# EasyEDA schematic Sheet_1.json
TITLE: ESP32 DevKit4 JTAG Break Out Board; REV: 1.0; Date: 2023-02-11; Sheet: 1/1; Drawn By: ralphbacon; Company: Arduino YouTube
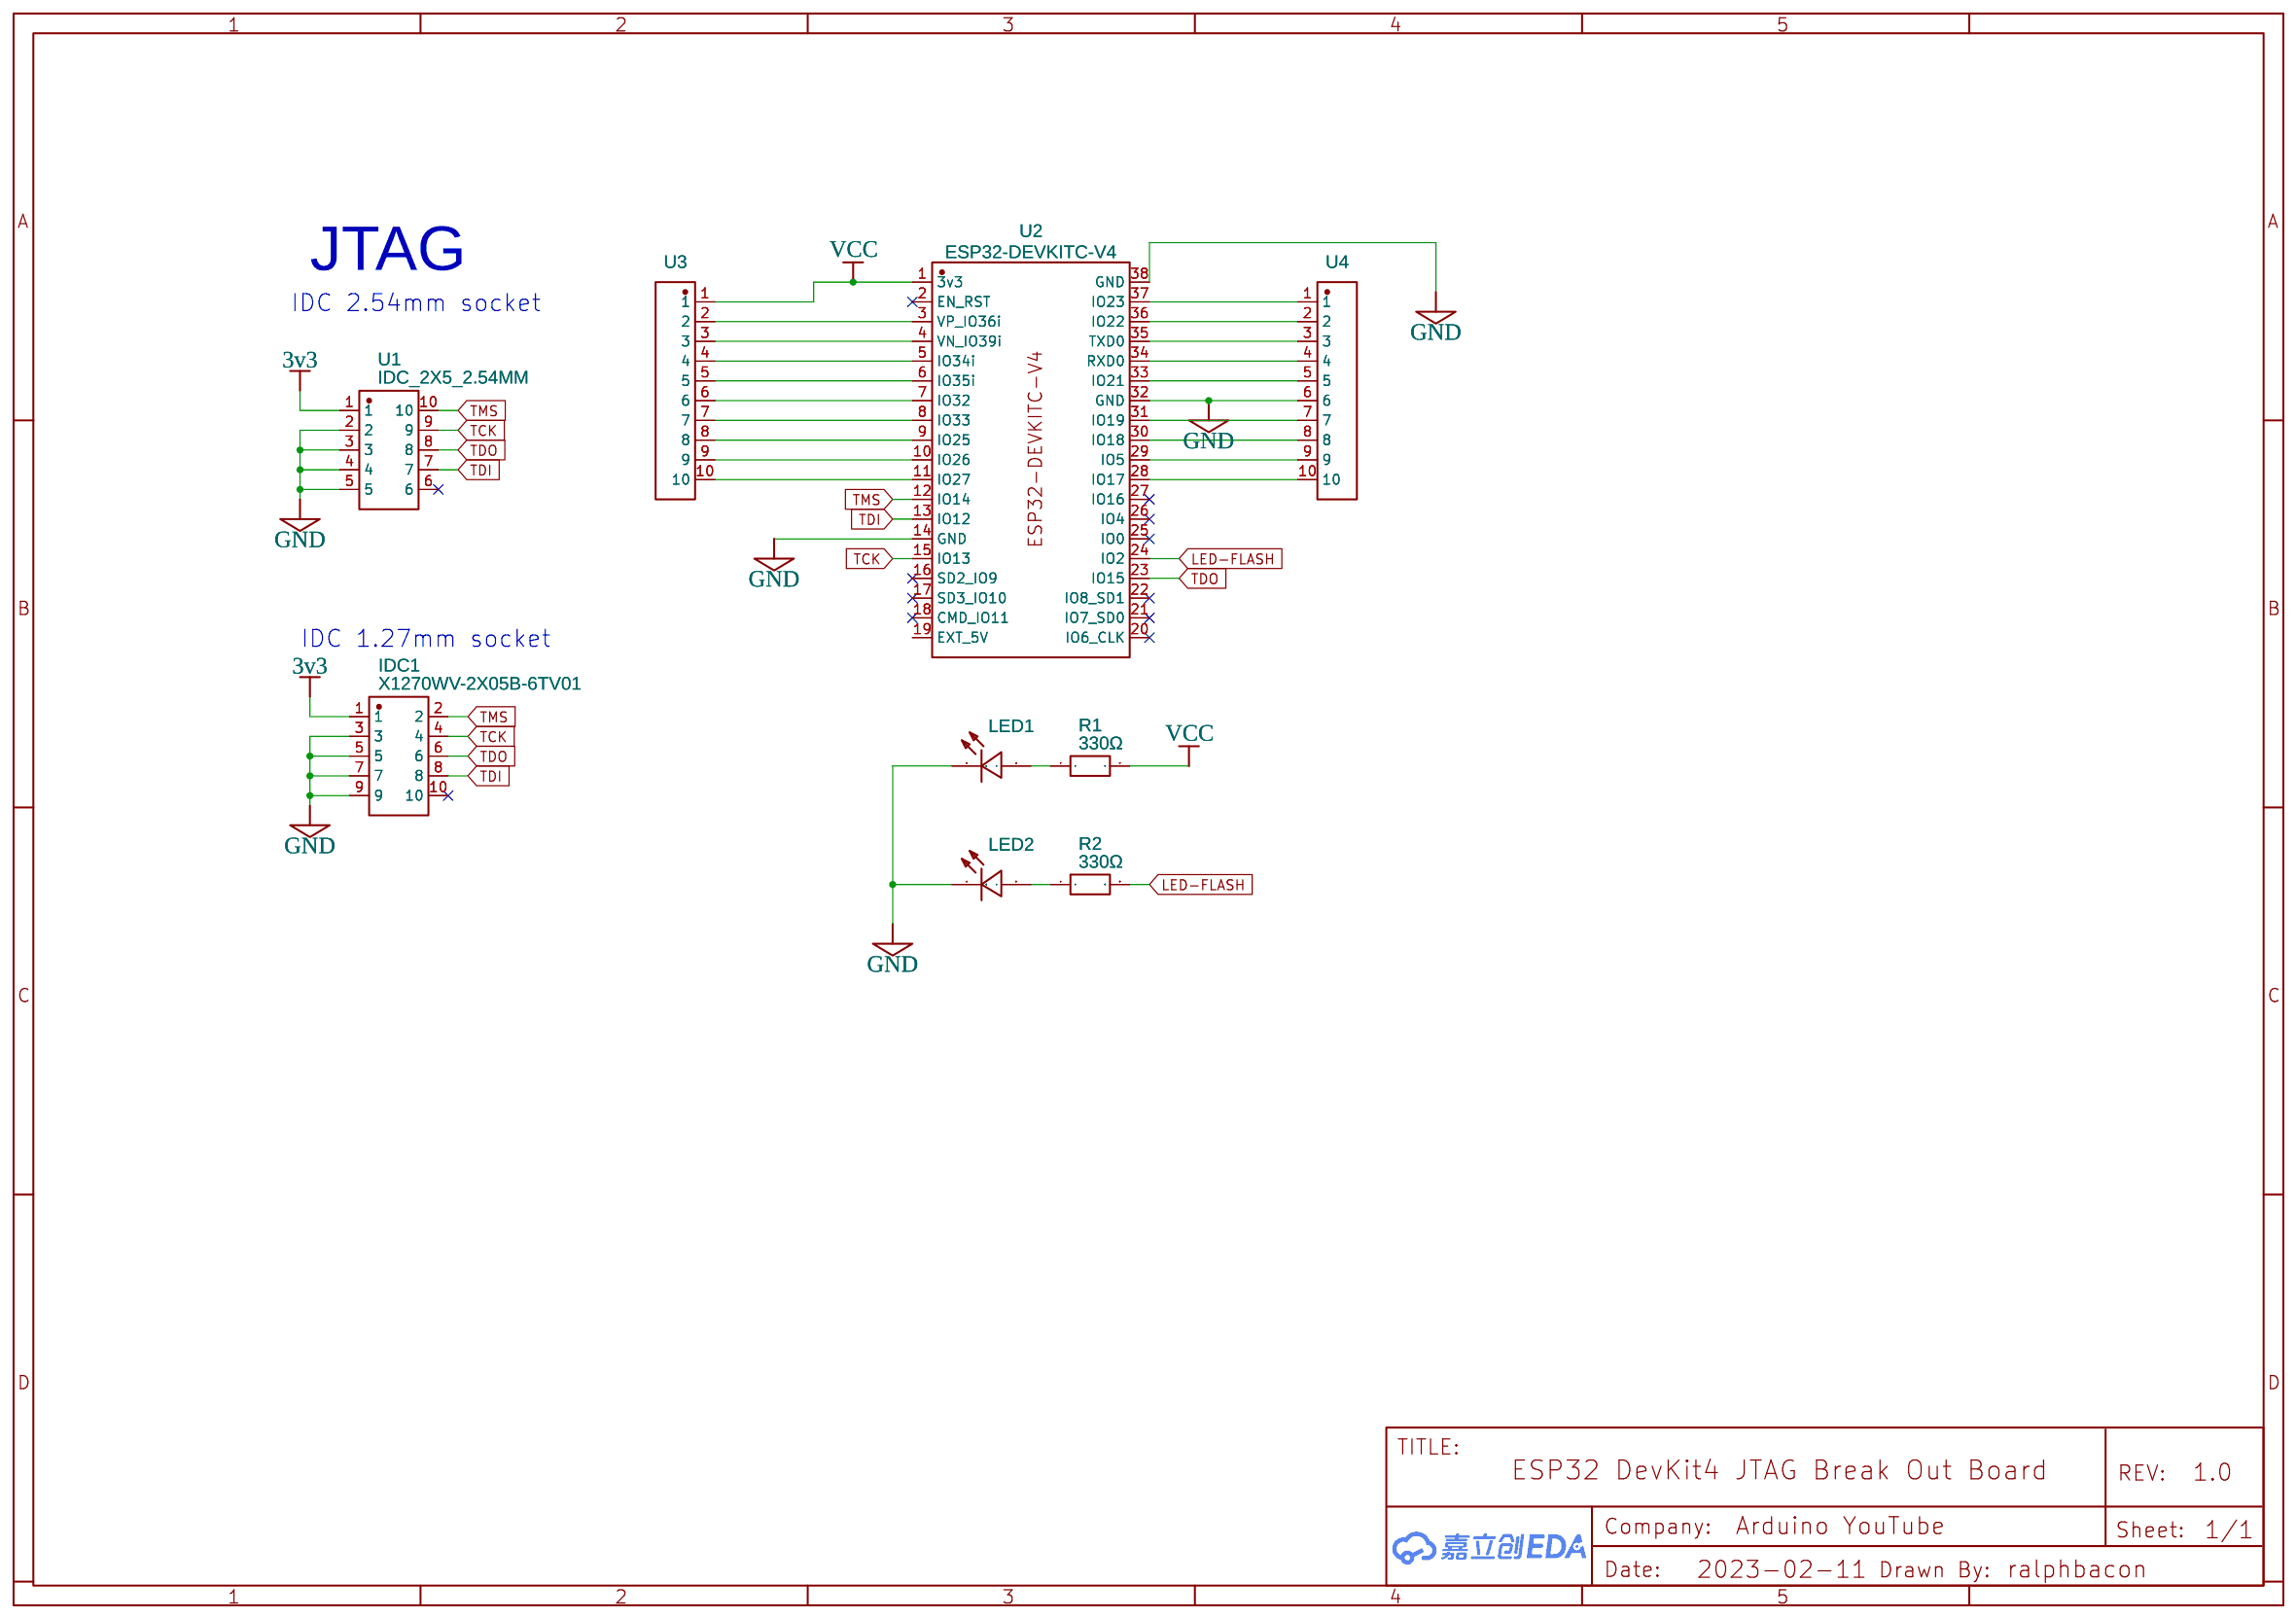
[diagram p0: schematic sheet]

## Parts
IDC1  X1270WV-2X05B-6TV01  [IDC-TH_10P-P1.27-X1270WV-2X05A-6TV01]
LED1  SMDREDLED红色超高亮0805  [LED0805-RD_RED]
LED2  SMDREDLED红色超高亮0805  [LED0805-RD_RED]
R1  330Ω  [R0603]
R2  330Ω  [R0603]
U1  IDC_2X5_2.54MM  [CONN-TH_DC3-10PS]
U2  ESP32-DEVKITC-V4  [ESP32-DEVKITC-V4]
U3  间距2.54MM蓝色排母座1X10PIN  [HDR-TH_10P-P2.54-V-F-2]
U4  间距2.54MM蓝色排母座1X10PIN  [HDR-TH_10P-P2.54-V-F-2]

## Library data of the parts
IDC1 = X1270WV-2X05B-6TV01: Supplier: LCSC; Supplier Part: C2962225; Manufacturer: XKB Connectivity(中国星坤); Manufacturer Part: X1270WV-2x05B-6TV01; link: https://atta.szlcsc.com/upload/public/pdf/source/20220119/EEE69E132D70AAE9A26E93059D34F2BD.pdf; JLCPCB Part Class: Extended Part; Contributor: lcsc
LED1 LED2 = SMDREDLED红色超高亮0805: Supplier: LCSC; Supplier Part: C9900019100; Manufacturer: null; Manufacturer Part: SMDRedLED红色超高亮0805; JLCPCB Part Class: Extended Part; Contributor: lcsc
R1 R2 = RT0603DRD07330RL: Supplier: LCSC; Supplier Part: C723588; Manufacturer: YAGEO(国巨); Contributor: LCSC; JLCPCB Part Class: Extended Part
U1 = IDC_2X5_2.54MM: Supplier: LCSC; Supplier Part: C9900012100; Manufacturer: null; Manufacturer Part: IDC_2x5_2.54mm; link: https://atta.szlcsc.comnull; JLCPCB Part Class: Extended Part; Contributor: LCSC
U2 = ESP32-DevKitC v4: Supplier: LCSC; link: https://docs.espressif.com/projects/esp-idf/en/latest/esp32/hw-reference/esp32/get-started-devkitc.html; Contributor: AlexAndersson
U3 U4 = 间距2.54MM蓝色排母座1X10PIN: Supplier: LCSC; Supplier Part: C9900015505; Manufacturer: null; Manufacturer Part: 间距2.54mm蓝色排母座1x10pin; JLCPCB Part Class: Extended Part; Contributor: lcsc

## Nets
3v3: IDC1.1 U1.1
GND: IDC1.3 IDC1.5 IDC1.7 IDC1.9 LED1.1(C) LED2.1(C) U1.2 U1.3 U1.4 U1.5 U2.14(GND) U2.32(GND) U2.38(GND) U4.6
VCC: R1.2 U2.1(3v3) U3.1
LED-FLASH: R2.2 U2.24(IO2)
TCK: IDC1.4 U1.9 U2.15(IO13)
TDI: IDC1.8 U1.7 U2.13(IO12)
TDO: IDC1.6 U1.8 U2.23(IO15)
TMS: IDC1.2 U1.10 U2.12(IO14)
Net-(LED1-2): LED1.2(A) R1.1
Net-(LED2-2): LED2.2(A) R2.1
Net-(U2-3): U2.3(VP IO36i) U3.2
Net-(U2-4): U2.4(VN IO39i) U3.3
Net-(U2-5): U2.5(IO34i) U3.4
Net-(U2-6): U2.6(IO35i) U3.5
Net-(U2-7): U2.7(IO32) U3.6
Net-(U2-8): U2.8(IO33) U3.7
Net-(U2-9): U2.9(IO25) U3.8
Net-(U2-10): U2.10(IO26) U3.9
Net-(U2-11): U2.11(IO27) U3.10
Net-(U2-28): U2.28(IO17) U4.10
Net-(U2-29): U2.29(IO5) U4.9
Net-(U2-30): U2.30(IO18) U4.8
Net-(U2-31): U2.31(IO19) U4.7
Net-(U2-33): U2.33(IO21) U4.5
Net-(U2-34): U2.34(RXD0) U4.4
Net-(U2-35): U2.35(TXD0) U4.3
Net-(U2-36): U2.36(IO22) U4.2
Net-(U2-37): U2.37(IO23) U4.1

Not connected (* = marked no-connect by the designer): IDC1 10*; U1 6*; U2 2(EN RST)* 16(SD2 IO9)* 17(SD3 IO10)* 18(CMD IO11)* 19(EXT_5V) 20(IO6 CLK)* 21(IO7 SD0)* 22(IO8 SD1)* 25(IO0)* 26(IO4)* 27(IO16)*

## Notes on the sheet
- JTAG
- IDC 2.54mm socket
- IDC 1.27mm socket
